# Altium project PulseBoard.PrjPcb
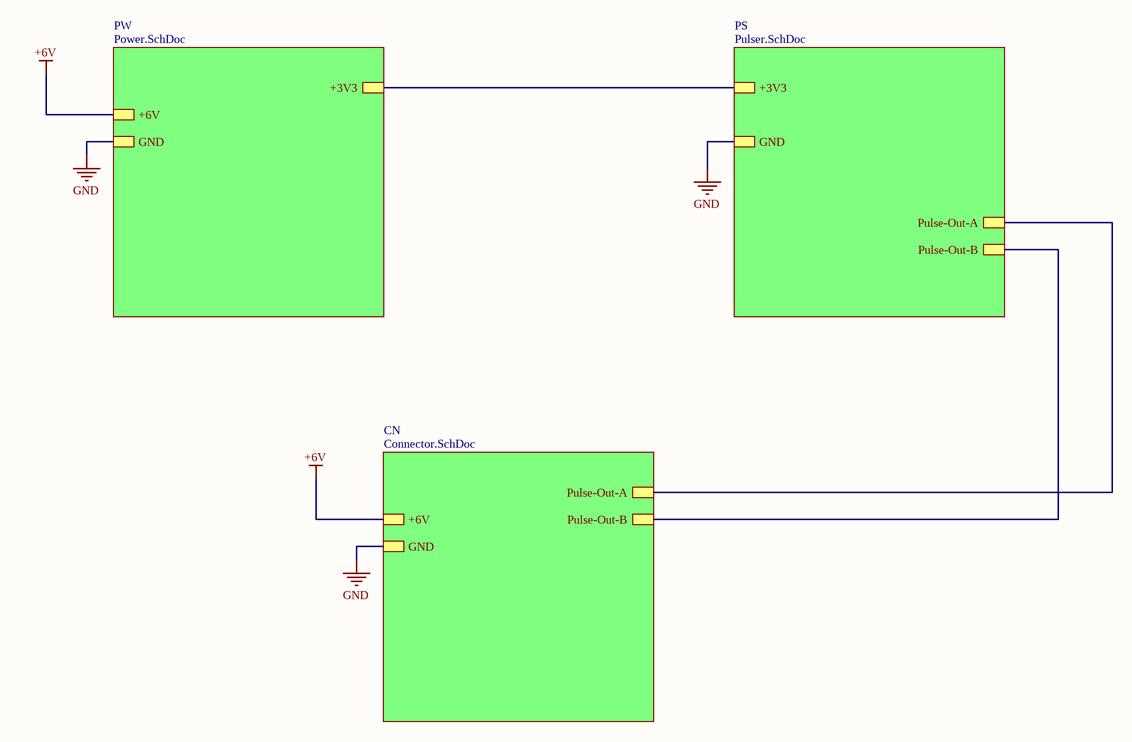
[diagram p0: Top.SchDoc]
4 sheets, 15 parts. Net scope: hierarchical (ports join the sheet entries above them; power ports are global).
Board file: PCB.PcbDoc
Sheets:
  Top.SchDoc
    PW = Power.SchDoc
    PS = Pulser.SchDoc
    CN = Connector.SchDoc

## Sheet Top.SchDoc
size B

### Sub-sheets
CN = Connector.SchDoc: GND, +6V, Pulse-Out-A, Pulse-Out-B
PS = Pulser.SchDoc: +3V3, GND, Pulse-Out-B, Pulse-Out-A
PW = Power.SchDoc: +6V, GND, +3V3

### Nets
+3V3: sheet PW/+3V3, sheet PS/+3V3
+6V: sheet PW/+6V, sheet CN/+6V
GND: sheet PW/GND, sheet PS/GND, sheet CN/GND
NetJ1_1: sheet PS/Pulse-Out-B, sheet CN/Pulse-Out-B
NetJ2_1: sheet PS/Pulse-Out-A, sheet CN/Pulse-Out-A

## Sheet Power.SchDoc
size B
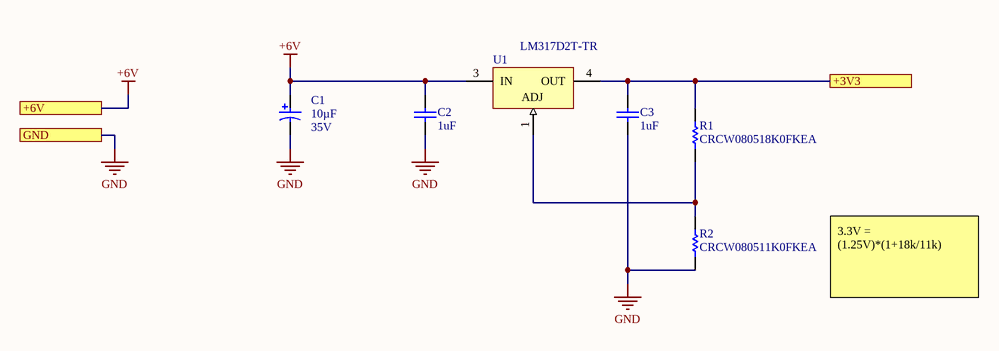
[diagram p1: Power.SchDoc]

### Parts
C1  Rated Voltage: 35V  Capacitance: 10µF  [PNSC-FK-V-B_V]  (hidden comment: EEE-FK1V100UR)
C2  1uF  [CAPC2013X100X50NL20T25]
C3  1uF  [CAPC2013X100X50NL20T25]
R1  CRCW080518K0FKEA  [RESC2013X50X30NL20T20]
R2  CRCW080511K0FKEA  [RESC2013X50X30NL20T20]
U1  LM317D2T-TR  [TO-263_N]

### Ports
+3V3, +6V, GND

### Nets
+3V3: C3.2 R1.2 U1.4(OUT) ; port +3V3
+6V: C1.1 C2.2 U1.3(IN) ; port +6V
GND: C1.2 C2.1 C3.1 R2.1 ; port GND
NetR1_1: R1.1 R2.2 U1.1(ADJ)

### Notes on the sheet
- 3.3V = (1.25V)*(1+18k/11k)

### Library data of the parts
C1 = CMP-2000-06211-1: Aluminum Electrolytic Capacitor, 10 uF, +/- 20%, 35 V, 2-Pin SMD (Size Code B), -55 to 105 degC, RoHS, Tape and Reel; Manufacturer: Panasonic; Impedance: 1.35O; Lifetime@Temperature: 2000Hrs@105°C; Ripple Current: 90mA; Type: Can; Manufacturer URL: http://www.panasonic.com/; Package Reference: FK-V-B; Operating Temp Range: -55to+105°C; Series: FK; Datasheet URL: http://industrial.panasonic.com/cdbs/www-data/pdf/RDE0000/ABA0000C1181.pdf; Mounting Technology: SurfaceMount; Package URL: http://industrial.panasonic.com/cdbs/www-data/pdf/RDE0000/DME0000COL48.pdf; Package Description: 2-Pin Electrolytic Aluminum Capacitor, Body 4.3 x 4.3 mm; Datasheet Version: 03/2016; Case Size/Dimension: Ø4x5.8mm; Operating Temp-Max: 105°C
C2 C3 = CMP-2007-03716-1: Part Number: C0805X105K3RACTU; Manufacturer: Kemet
R1 = CMP-2001-03588-1: Manufacturer: Vishay Dale; Part Number: CRCW080518K0FKEA
R2 = CMP-2001-04924-1: Manufacturer: Vishay Dale; Part Number: CRCW080511K0FKEA
U1 = CMP-0244-00094-1: 1.5A, 1.2V to 37V Adjustable Voltage Regulator, 3-Pin D2PAK, Tape and Reel; DatasheetVersion: 1/11/2011; PackageVersion: 2011; PackageDescription: 3-Pin Transistor Outline Package 2.54 mm Pitch, 15.4 mm Lead Span (D2PAK); ComponentLink2URL: http://www.st.com/internet/com/TECHNICAL_RESOURCES/TECHNICAL_LITERATURE/DATASHEET/CD00000455.pdf; PackageReference: TO-263; ComponentLink1Description: Manufacturer URL; ComponentLink2Description: Datasheet; ComponentLink1URL: http://www.st.com

## Sheet Pulser.SchDoc
size B
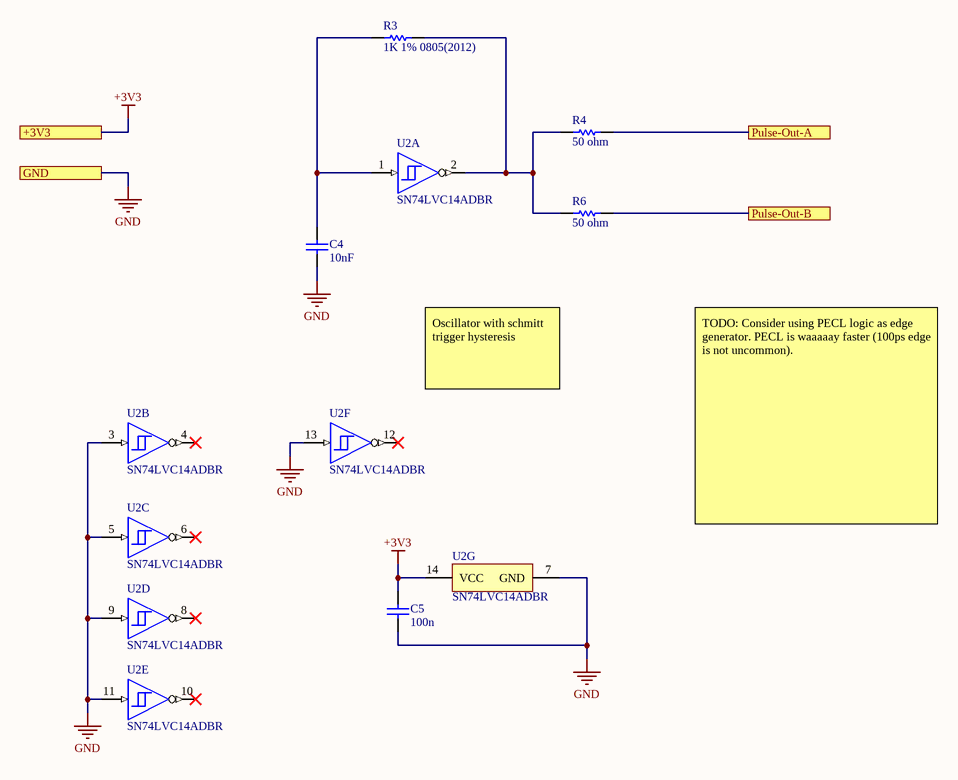
[diagram p2: Pulser.SchDoc]

### Parts
C4  10nF  [CAPC2013X88X50LL20T25]
C5  value 100n  [CAPC2013X88X50NL20T25]  (hidden comment: C0805C104K5RACTU)
R3  1K 1% 0805(2012)  [RESC0805(2012)_M]
R4  50 ohm  [RESC1609X50X30NL10T20]
R6  50 ohm  [RESC1609X50X30NL10T20]
U2  SN74LVC14ADBR  [DB0014A_M]  (parts A,B,C,D,E,F,G of 7)

### Ports
+3V3, GND, Pulse-Out-A, Pulse-Out-B

### Nets
+3V3: C5.2 U2.14(VCC) ; port +3V3
GND: C4.1 C5.1 U2.3(2A) U2.5(3A) U2.7(GND) U2.9(4A) U2.11(5A) U2.13(6A) ; port GND
NetC4_2: C4.2 R3.1 U2.1(1A)
NetJ1_1: R6.2 ; port Pulse-Out-B
NetJ2_1: R4.2 ; port Pulse-Out-A
NetR3_2: R3.2 R4.1 R6.1 U2.2(~{1Y})

Not connected (* = marked no-connect by the designer): U2 4(~{2Y})* 6(~{3Y})* 8(~{4Y})* 10(~{5Y})* 12(~{6Y})*

### Notes on the sheet
- Oscillator with schmitt trigger hysteresis
- TODO: Consider using PECL logic as edge generator. PECL is waaaaay faster (100ps edge is not uncommon).

### Library data of the parts
C4 = CMP-2007-00493-1: Part Number: C0805C103J3GACTU; Manufacturer: Kemet
C5 = CMP-2007-00279-1: Manufacturer: Kemet; Part Number: C0805C104K5RACTU
R3 = CMP-1013-00510-1: 1K 0.125W 1% 0805 (2012 Metric)  SMD; Case-Metric: 2012; Value: 1000.00 Ohm; Case-EIA: 0805; Tolerance: 1 %; Power: 0.125 W; Technology: SMT
R4 R6 = CMP-2000-03436-1: Part Number: CRCW060350R0FKEA; Manufacturer: Vishay Dale
U2 = CMP-1615-00327-3: Hex Schmitt-Trigger Inverter, DB0014A, LARGE T&R; Manufacturer: Texas Instruments; tpd @ Nom Voltage(Max)(ns): 11,7.8,7.5,6.4; Output Type: CMOS; Voltage(Nom)(V): 1.8,2.5,2.7,3.3; F @ Nom Voltage(Max)(Mhz): 100; ICC @ Nom Voltage(Max)(mA): 0.01; Input Type: CMOS,TTL; VCC(Max)(V): 3.6; Schmitt Trigger: Yes; Technology Family: LVC; VCC(Min)(V): 2; Output Drive (IOL/IOH)(Max)(mA): -24/24; Bits(#): 6; Rating: Catalog; Code_JEDEC: MO-150; PackageReference: DB0014A; Generic Part Number: SN74LVC14A; Operating Temperature Range(C): -40 to 125; DatasheetVersion: SCAS285AA

## Sheet Connector.SchDoc
size B
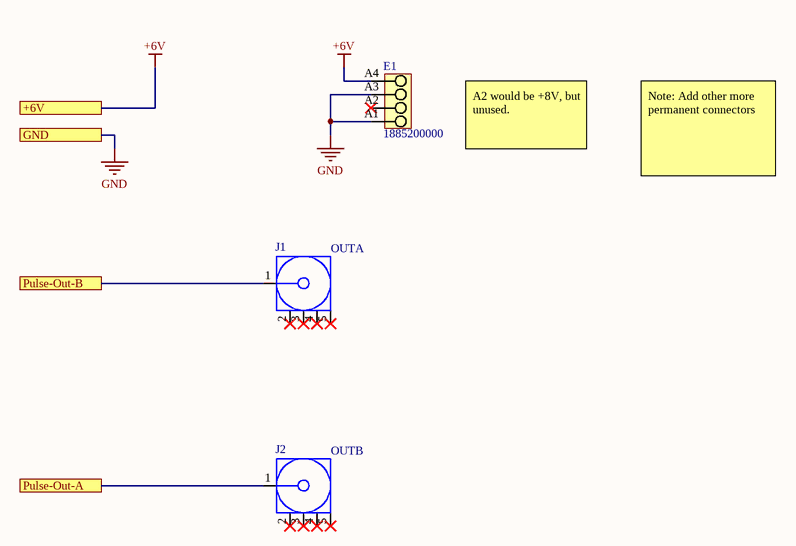
[diagram p3: Connector.SchDoc]

### Parts
E1  1885200000  [LSF_SMT_3_5_135_04]
J1  OUTA  [MOLX-731000114_V]
J2  OUTB  [MOLX-731000114_V]

### Ports
+6V, GND, Pulse-Out-A, Pulse-Out-B

### Nets
+6V: E1.A4 ; port +6V
GND: E1.A1 E1.A3 ; port GND
NetJ1_1: J1.1 ; port Pulse-Out-B
NetJ2_1: J2.1 ; port Pulse-Out-A

Not connected (* = marked no-connect by the designer): E1 A2*; J1 2* 3* 4* 5*; J2 2* 3* 4* 5*

### Notes on the sheet
- A2 would be +8V, but unused.
- Note: Add other more permanent connectors

### Library data of the parts
E1 = CMP-1559-02099-1: OMNIMATE Signal - series LSF; Manufacturer: Weidmueller; Pitch_inch: 0,138 inch; Contact_material: Cu-Leg; Mounting_onto_the_PCB: Reflow solder connection; Rated_voltage_use_group_B_UL_1059: 300 V; Side_termination_characteristic: closed side; Wire_cross_section_AWG_min_UL_1059: AWG 24; Solid_min_H05_07_V_U: 0,2 mm²; No_of_poles: 4; Pitch_mm: 3,5 mm; Solder_pin_length_mm: 1,5 mm; Wire_cross_section_AWG_max_UL_1059: AWG 16; Contact_surface: tinned; Solid_max_H05_07_V_U: 1,5 mm²; Short_text_for_material: LSF-SMT 3.50/04/135 1.5SN BK TU; Rated_current_min_no_of_poles_TU_20_deg_C: 19 A; Rated_current_use_group_B_UL_1059: 12 A; Rated_voltage_for_surge_voltage_class_pollution_degree_II_2: 320 V; Insulating_material: LCP GF; UL_94_flammability_rating: V-0; ComponentLink1URL: http://www.weidmueller.com/; ComponentLink1Description: Manufacturer URL; ComponentLink2URL: http://catalog.weidmueller.com/catalog/Start.do?localeId=en&ObjectID=1885200000; PackageReference: LSF_SMT_3_5_135_04; Qty: 37 PCS; Revision: V1; ComponentLink2Description: URL Link1; PartNumber: 1885200000; Packaging: Tube; Colour: Black
J1 J2 = CMP-2000-05487-1: SMA Right-Angle PCB Jack Receptacle, Brass Body, Gold Plated, 50 Ohm, 5-Pin THD, RoHS, Tray; Manufacturer: Molex; Datasheet Version: 09/2016; Package Description: 5-Pin Through Hole Device, Body 14.8 x 6.35 mm, Pitch 2.54 mm; Datasheet URL: http://www.molex.com/webdocs/datasheets/pdf/en-us/0731000114_RF_COAX_CONNECTORS.pdf; Manufacturer URL: http://www.molex.com/; Package Reference: 731000114; Mounting Technology: ThroughHole; Package URL: http://www.molex.com/pdm_docs/sd/731000114_sd.pdf

## Nets that join several sheets
+3V3: Power (C3.2 R1.2 U1.4), Pulser (C5.2 U2.14)
+6V: Power (C1.1 C2.2 U1.3), Connector (E1.A4)
GND: Power (C1.2 C2.1 C3.1 R2.1), Pulser (8 pins), Connector (E1.A1 E1.A3)
NetJ1_1: Pulser (R6.2), Connector (J1.1)
NetJ2_1: Pulser (R4.2), Connector (J2.1)